# Altium project MB.PrjPcb (part 3 of 3)

## Sheet MB_dac.SchDoc: Материнская плата
size 420 x 297 mm; DrawnBy: В.Титов; DocumentNumber: ХХХХ.468179.001 Э3; SheetNumber: 6; SheetTotal: 7; DocumentType: Схема электрическая принципиальная; Title2: Питание процессора
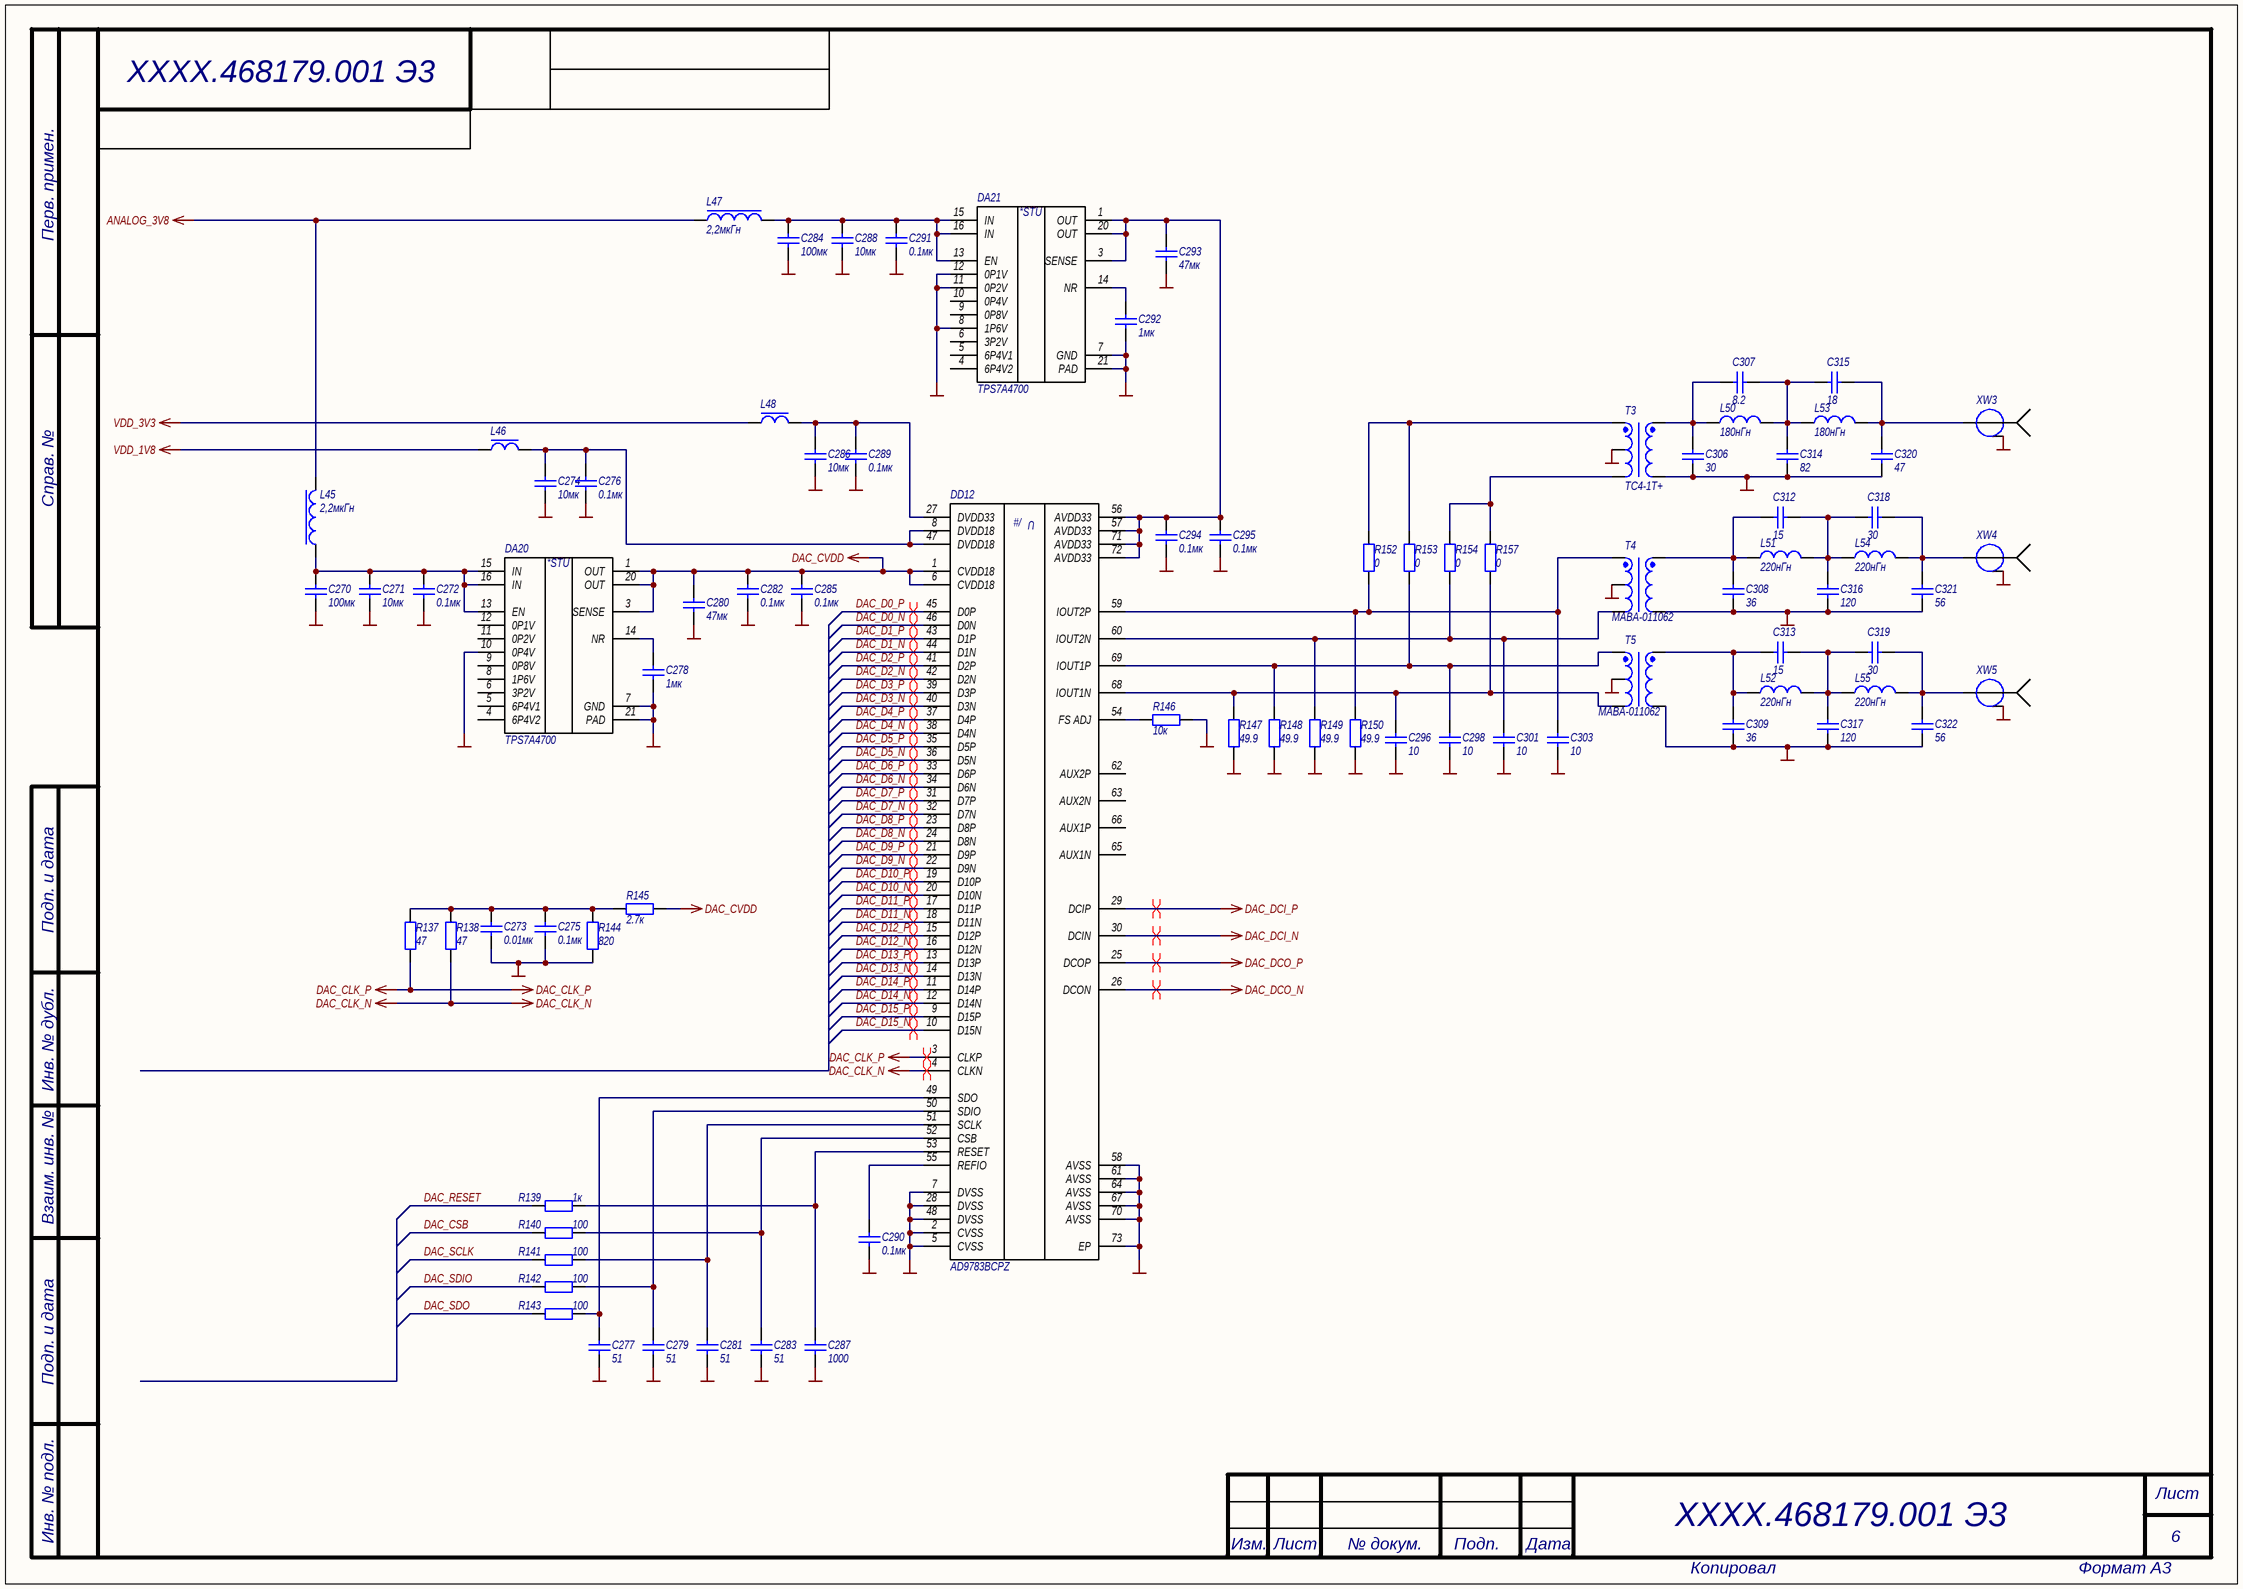
[diagram p5: MB_dac.SchDoc]

### Parts
C270  100мк  [CAPC3216X19L]
C271  10мк  [CAPC1608X08L]
C272  0.1мк  [CAPC1005X06N]
C273  0.01мк  [CAPC1005X06N]
C274  10мк  [CAPC1608X08L]
C275  0.1мк  [CAPC1005X06N]
C276  0.1мк  [CAPC1005X06N]
C277  51  [CAPC1005X06N]
C278  1мк  [CAPC1005X06N]
C279  51  [CAPC1005X06N]
C280  47мк  [CAPC2012X12L]
C281  51  [CAPC1005X06N]
C282  0.1мк  [CAPC1005X06N]
C283  51  [CAPC1005X06N]
C284  100мк  [CAPC3216X19L]
C285  0.1мк  [CAPC1005X06N]
C286  10мк  [CAPC1608X08L]
C287  1000  [CAPC1005X06N]
C288  10мк  [CAPC1608X08L]
C289  0.1мк  [CAPC1005X06N]
C290  0.1мк  [CAPC1005X06N]
C291  0.1мк  [CAPC1005X06N]
C292  1мк  [CAPC1005X06N]
C293  47мк  [CAPC2012X12L]
C294  0.1мк  [CAPC1005X06N]
C295  0.1мк  [CAPC1005X06N]
C296  10  [CAPC1005X06N]
C298  10  [CAPC1005X06N]
C301  10  [CAPC1005X06N]
C303  10  [CAPC1005X06N]
C306  30  [CAPC1005X06N]
C307  8.2  [CAPC1005X06N]
C308  36  [CAPC1005X06N]
C309  36  [CAPC1005X06N]
C312  15  [CAPC1005X06N]
C313  15  [CAPC1005X06N]
C314  82  [CAPC1005X06N]
C315  18  [CAPC1005X06N]
C316  120  [CAPC1005X06N]
C317  120  [CAPC1005X06N]
C318  30  [CAPC1005X06N]
C319  30  [CAPC1005X06N]
C320  47  [CAPC1005X06N]
C321  56  [CAPC1005X06N]
C322  56  [CAPC1005X06N]
DA20  TPS7A4700  [QFN65P500X500X100_HS-21L]
DA21  TPS7A4700  [QFN65P500X500X100_HS-21L]
DD12  AD9783BCPZ  [LFCSP_VQ_72]
L45  2,2мкГн  [CSAB0420]
L46  BLM18PG121SN1D  [INDC1608X08L]  (value not drawn)
L47  2,2мкГн  [CSAB0420]
L48  BLM18PG121SN1D  [INDC1608X08L]  (value not drawn)
L50  180нГн  [INDC0805CS]
L51  220нГн  [INDC0805CS]
L52  220нГн  [INDC0805CS]
L53  180нГн  [INDC0805CS]
L54  220нГн  [INDC0805CS]
L55  220нГн  [INDC0805CS]
R137  47  [RESC1005X06N]
R138  47  [RESC1005X06N]
R139  1к  [RESC1005X06N]
R140  100  [RESC1005X06N]
R141  100  [RESC1005X06N]
R142  100  [RESC1005X06N]
R143  100  [RESC1005X06N]
R144  820  [RESC1005X06N]
R145  2.7к  [RESC1005X06N]
R146  10к  [RESC1005X06N]
R147  49.9  [RESC1005X06N]
R148  49.9  [RESC1005X06N]
R149  49.9  [RESC1005X06N]
R150  49.9  [RESC1005X06N]
R152  0  [RESC1005X06N]
R153  0  [RESC1005X06N]
R154  0  [RESC1005X06N]
R157  0  [RESC1005X06N]
T3  TC4-1T+  [SM-22 package]
T4  MABA-011062  [SM-22 package]
T5  MABA-011062  [SM-22 package]
XW3  SMA-JR  [SMA-JR]  (value not drawn)
XW4  SMA-JR  [SMA-JR]  (value not drawn)
XW5  SMA-JR  [SMA-JR]  (value not drawn)

### Nets
ANALOG_3V8: L45.2 L47.1
DAC_CLK_N: DD12.4(CLKN) R138.2
DAC_CLK_P: DD12.3(CLKP) R137.2
DAC_CVDD: C280.2 C282.2 C285.2 DA20.1(OUT) DA20.3(SENSE) DA20.20(OUT) DD12.1(CVDD18) DD12.6(CVDD18) R145.2
DAC_DCI_N: DD12.30(DCIN)
DAC_DCI_P: DD12.29(DCIP)
DAC_DCO_N: DD12.26(DCON)
DAC_DCO_P: DD12.25(DCOP)
GND: C270.1 C271.1 C272.1 C273.1 C274.1 C275.1 C276.1 C277.1 C278.1 C279.1 C280.1 C281.1 C282.1 C283.1 C284.1 C285.1 C286.1 C287.1 C288.1 C289.1 C290.1 C291.1 C292.1 C293.1 C294.1 C295.1 C296.1 C298.1 C301.1 C303.1 C306.1 C308.1 C309.1 C314.1 C316.1 C317.1 C320.1 C321.1 C322.1 DA20.7(GND) DA20.10(0P4V) DA20.21(PAD) DA21.7(GND) DA21.8(1P6V) DA21.11(0P2V) DA21.12(0P1V) DA21.21(PAD) DD12.2(CVSS) DD12.5(CVSS) DD12.7(DVSS) DD12.28(DVSS) DD12.48(DVSS) DD12.58(AVSS) DD12.61(AVSS) DD12.64(AVSS) DD12.67(AVSS) DD12.70(AVSS) DD12.73(EP) R144.2 R146.2 R147.2 R148.2 R149.2 R150.2 T3.2(SECONARY_CT) T3.4(PRIMARY) T4.2(SECONARY_CT) T4.4(PRIMARY) T5.2(SECONARY_CT) T5.4(PRIMARY) XW3.2 XW4.2 XW5.2
VDD_1V8: L46.1
VDD_3V3: L48.1
DAC_CSB: R140.1
DAC_D0_N: DD12.46(D0N)
DAC_D0_P: DD12.45(D0P)
DAC_D1_N: DD12.44(D1N)
DAC_D1_P: DD12.43(D1P)
DAC_D2_N: DD12.42(D2N)
DAC_D2_P: DD12.41(D2P)
DAC_D3_N: DD12.40(D3N)
DAC_D3_P: DD12.39(D3P)
DAC_D4_N: DD12.38(D4N)
DAC_D4_P: DD12.37(D4P)
DAC_D5_N: DD12.36(D5N)
DAC_D5_P: DD12.35(D5P)
DAC_D6_N: DD12.34(D6N)
DAC_D6_P: DD12.33(D6P)
DAC_D7_N: DD12.32(D7N)
DAC_D7_P: DD12.31(D7P)
DAC_D8_N: DD12.24(D8N)
DAC_D8_P: DD12.23(D8P)
DAC_D9_N: DD12.22(D9N)
DAC_D9_P: DD12.21(D9P)
DAC_D10_N: DD12.20(D10N)
DAC_D10_P: DD12.19(D10P)
DAC_D11_N: DD12.18(D11N)
DAC_D11_P: DD12.17(D11P)
DAC_D12_N: DD12.16(D12N)
DAC_D12_P: DD12.15(D12P)
DAC_D13_N: DD12.14(D13N)
DAC_D13_P: DD12.13(D13P)
DAC_D14_N: DD12.12(D14N)
DAC_D14_P: DD12.11(D14P)
DAC_D15_N: DD12.10(D15N)
DAC_D15_P: DD12.9(D15P)
DAC_RESET: R139.1
DAC_SCLK: R141.1
DAC_SDIO: R142.1
DAC_SDO: R143.1
NetC270_2: C270.2 C271.2 C272.2 DA20.13(EN) DA20.15(IN) DA20.16(IN) L45.1
NetC273_2: C273.2 C275.2 R137.1 R138.1 R144.1 R145.1
NetC274_2: C274.2 C276.2 DD12.8(DVDD18) DD12.47(DVDD18) L46.2
NetC277_2: C277.2 DD12.49(SDO) R143.2
NetC278_2: C278.2 DA20.14(NR)
NetC279_2: C279.2 DD12.50(SDIO) R142.2
NetC281_2: C281.2 DD12.51(SCLK) R141.2
NetC283_2: C283.2 DD12.52(CSB) R140.2
NetC284_2: C284.2 C288.2 C291.2 DA21.13(EN) DA21.15(IN) DA21.16(IN) L47.2
NetC286_2: C286.2 C289.2 DD12.27(DVDD33) L48.2
NetC287_2: C287.2 DD12.53(RESET) R139.2
NetC290_2: C290.2 DD12.55(REFIO)
NetC292_2: C292.2 DA21.14(NR)
NetC293_2: C293.2 C294.2 C295.2 DA21.1(OUT) DA21.3(SENSE) DA21.20(OUT) DD12.56(AVDD33) DD12.57(AVDD33) DD12.71(AVDD33) DD12.72(AVDD33)
NetC296_2: C296.2 DD12.68(IOUT1N) R147.1 R157.2 T5.3(SECONDARY)
NetC298_2: C298.2 DD12.69(IOUT1P) R148.1 R153.2 T5.1(SECONDARY_DOT)
NetC301_2: C301.2 DD12.60(IOUT2N) R149.1 R154.2 T4.3(SECONDARY)
NetC303_2: C303.2 DD12.59(IOUT2P) R150.1 R152.2 T4.1(SECONDARY_DOT)
NetC306_2: C306.2 C307.2 L50.1 T3.5(PRIMARY_DOT)
NetC307_1: C307.1 C314.2 C315.2 L50.2 L53.1
NetC308_2: C308.2 C312.2 L51.1 T4.5(PRIMARY_DOT)
NetC309_2: C309.2 C313.2 L52.1 T5.5(PRIMARY_DOT)
NetC312_1: C312.1 C316.2 C318.2 L51.2 L54.1
NetC313_1: C313.1 C317.2 C319.2 L52.2 L55.1
NetC315_1: C315.1 C320.2 L53.2 XW3.1
NetC318_1: C318.1 C321.2 L54.2 XW4.1
NetC319_1: C319.1 C322.2 L55.2 XW5.1
NetDD12_54: DD12.54(FS_ADJ) R146.1
NetR152_1: R152.1 R153.1 T3.1(SECONDARY_DOT)
NetR154_1: R154.1 R157.1 T3.3(SECONDARY)

Not connected (* = marked no-connect by the designer): DA20 4(6P4V2) 5(6P4V1) 6(3P2V) 8(1P6V) 9(0P8V) 11(0P2V) 12(0P1V); DA21 4(6P4V2) 5(6P4V1) 6(3P2V) 9(0P8V) 10(0P4V); DD12 62(AUX2P) 63(AUX2N) 65(AUX1N) 66(AUX1P)

### Layout directives
differential pair: DAC_CLK_N, DAC_CLK_P, DAC_D0_N, DAC_D0_P, DAC_D1_N, DAC_D1_P, DAC_D2_N, DAC_D2_P, DAC_D3_N, DAC_D3_P, DAC_D4_N, DAC_D4_P, DAC_D5_N, DAC_D5_P, DAC_D6_N, DAC_D6_P, DAC_D7_N, DAC_D7_P, DAC_D8_N, DAC_D8_P, DAC_D9_N, DAC_D9_P, DAC_D10_N, DAC_D10_P, DAC_D11_N, DAC_D11_P, DAC_D12_N, DAC_D12_P, DAC_D13_N, DAC_D13_P, DAC_D14_N, DAC_D14_P, DAC_D15_N, DAC_D15_P, DAC_DCI_N, DAC_DCI_P, DAC_DCO_N, DAC_DCO_P

### Notes on the sheet
- Перв. примен.
- Справ. №
- Подп. и дата
- Инв. № дубл.
- Взаим. инв. №
- Инв. № подл.
- Лист
- Изм.
- № докум.
- Подп.
- Дата
- Копировал
- Формат А3
- (in symbol Микросхема AD9783BCPZ) U; #/
- (in symbol Микросхема TPS7A4700RGW) *STU

### Library data of the parts
C270 C284 = Кер.ЧИП конд. 1206 100мкФ X5R 20% 6.3В: Кер. ЧИП-конденсатор; Manufacturer: Murata; ManufacturerPartNumber: GRM31CR60J107ME39L; Power/Voltage: 6.3В; TKE: X5R; Tolerance: ±20%; Value: 100мк
C271 C274 C286 C288 = Кер.ЧИП конд. 0603 10мкФ X5R 20% 6.3В: Кер. ЧИП-конденсатор; Manufacturer: Murata; ManufacturerPartNumber: GRM188R61A106KE69D; Power/Voltage: 6.3В; TKE: X5R; Tolerance: ±20%; Value: 10мк
C272 C275 C276 C282 C285 C289-C291 C294 C295 = Кер.ЧИП конд. 0402 0.1мкФ X7R 10%, 16В: Кер. ЧИП-конденсатор; Power/Voltage: 16В; TKE: X7R; Tolerance: ±10%; PackageReference: 0402; Value: 0.1мк
C273 = Кер.ЧИП конд. 0402 0.01мкФ X7R 10%, 50В: Кер. ЧИП-конденсатор; Power/Voltage: 50В; TKE: X7R; Tolerance: ±20%; Value: 0.01мк
C277 C279 C281 C283 = Кер.ЧИП конд. 0402 51пФ NPO 5%, 50В: Кер. ЧИП-конденсатор; Power/Voltage: 50В; TKE: NPO; Tolerance: ±5%; PackageReference: 0402; Value: 51
C278 C292 = Кер.ЧИП конд. 0402 1мкФ X5R 10%, 10В: Кер. ЧИП-конденсатор; Power/Voltage: 10В; TKE: X5R; Tolerance: ±10%; PackageReference: 0402; Value: 1мк
C280 C293 = Кер.ЧИП конд. 0805 47мкФ X5R 20% 10В: Кер. ЧИП-конденсатор; Manufacturer: Murata; ManufacturerPartNumber: GRM21BR61A476ME15L; Power/Voltage: 10В; TKE: X5R; Tolerance: ±20%; Value: 47мк
C287 = Кер.ЧИП конд. 0402 1000пФ NP0 5%, 50В: Кер. ЧИП-конденсатор; Power/Voltage: 50В; TKE: NPO; Tolerance: ±5%; PackageReference: 0402; Value: 1000
C296 C298 C301 C303 = Кер.ЧИП конд. 0402 10пФ NPO 5%, 50В: Кер. ЧИП-конденсатор; Power/Voltage: 50В; TKE: NPO; Tolerance: ±5%; PackageReference: 0402; Value: 10
C306 C318 C319 = Кер.ЧИП конд. 0402 30пФ NPO 5%, 50В: Кер. ЧИП-конденсатор; Power/Voltage: 50В; TKE: NPO; Tolerance: ±5%; PackageReference: 0402; Value: 30
C307 = Кер.ЧИП конд. 0402 8.2пФ C0G, 50В: Кер. ЧИП-конденсатор; Power/Voltage: 50В; TKE: C0G; Tolerance: ±5%; Value: 8.2
C308 C309 = Кер.ЧИП конд. 0402 36пФ NPO 5%, 50В: Кер. ЧИП-конденсатор; Power/Voltage: 50В; TKE: NPO; Tolerance: ±5%; PackageReference: 0402; Value: 36
C312 C313 = Кер.ЧИП конд. 0402 15пФ NPO 5%, 50В: Кер. ЧИП-конденсатор; Power/Voltage: 50В; TKE: NPO; Tolerance: ±5%; PackageReference: 0402; Value: 15
C314 = Кер.ЧИП конд. 0402 82пФ NPO 5%, 50В: Кер. ЧИП-конденсатор; Power/Voltage: 50В; TKE: NPO; Tolerance: ±5%; PackageReference: 0402; Value: 82
C315 = Кер.ЧИП конд. 0402 18пФ NPO 5%, 50В: Кер. ЧИП-конденсатор; Power/Voltage: 50В; TKE: NPO; Tolerance: ±5%; PackageReference: 0402; Value: 18
C316 C317 = Кер.ЧИП конд. 0402 120пФ NPO 5%, 50В: Кер. ЧИП-конденсатор; Power/Voltage: 50В; TKE: NPO; Tolerance: ±5%; PackageReference: 0402; Value: 120
C320 = Кер.ЧИП конд. 0402 47пФ NPO 5%, 50В: Кер. ЧИП-конденсатор; Power/Voltage: 50В; TKE: NPO; Tolerance: ±5%; PackageReference: 0402; Value: 47
C321 C322 = Кер.ЧИП конд. 0402 56пФ NPO 5%, 50В: Кер. ЧИП-конденсатор; Power/Voltage: 50В; TKE: NPO; Tolerance: ±5%; PackageReference: 0402; Value: 56
DA20 DA21 = Микросхема TPS7A4700RGW: 36-V, 1-A, 4-µVRMS, RF LDO Voltage Regulator; Manufacturer: TI; Value: TPS7A4700; ComponentLink1Description: datasheet; ComponentLink1URL: http://www.ti.com/lit/ds/symlink/tps7a47.pdf
DD12 = Микросхема AD9783BCPZ: Dual 12-/14-/16-Bit, LVDS Interface, 500 MSPS DACs; Manufacturer: AD; Value: AD9783BCPZ; ComponentLink1Description: datasheet; ComponentLink1URL: http://www.analog.com/media/en/technical-documentation/data-sheets/AD9780_9781_9783.pdf
L45 L47 = ЧИП индуктивность CSAB0420-2R2M: Molding Power Choke; Manufacturer: Vishay; ManufacturerPartNumber: IHLP1616ABER1R0M11; Value: 2,2мкГн
L46 L48 = ЧИП дроссель 0603 BLM18PG121SN1D: SMD EMI Suppression Filter EMIFIL; Manufacturer: Murata; ManufacturerPartNumber: BLM18PG121SN1D; Value: BLM18PG121SN1D
L50 L53 = ЧИП индуктивность 0805CS-181XGL: Value: 180нГн
L51 L52 L54 L55 = ЧИП индуктивность 0805CS-221XGL: Value: 220нГн
R137 R138 = Чип резистор 0402 47 Ом, 5%: ЧИП-резистор; Tolerance: ±5%; TKE: 100 ppm/°С; PackageReference: 0402; Value: 47
R139 = Чип резистор 0402 1 кОм, 5%: ЧИП-резистор; Tolerance: ±5%; TKE: 100 ppm/°С; PackageReference: 0402; Value: 1к
R140-R143 = Чип резистор 0402 100 Ом, 5%: ЧИП-резистор; Tolerance: ±5%; TKE: 100 ppm/°С; PackageReference: 0402; Value: 100
R144 = Чип резистор 0402 820 Ом, 5%: ЧИП-резистор; Tolerance: ±5%; TKE: 100 ppm/°С; PackageReference: 0402; Value: 820
R145 = Чип резистор 0402 2.7 кОм, 5%: ЧИП-резистор; Tolerance: ±5%; TKE: 100 ppm/°С; Published: 8-Jun-2000; LatestRevisionDate: 17-Jul-2002; LatestRevisionNote: Re-released for DXP Platform.; Publisher: Altium Limited; PackageReference: 0402; Value: 2.7к
R146 = Чип резистор 0402 10 кОм, 5%: ЧИП-резистор; Tolerance: ±5%; TKE: 100 ppm/°С; PackageReference: 0402; Value: 10к
R147-R150 = Чип резистор 0402 49,9 Ом, 1%: ЧИП-резистор; Tolerance: ±1%; TKE: 100 ppm/°С; PackageReference: 0402; Value: 49.9
R152-R154 R157 = Чип резистор 0402 0 Ом: ЧИП-резистор; Tolerance: ±5%; TKE: 100 ppm/°С; PackageReference: 0402; Value: 0
T3 = ЧИП трансформатор TC4-1T+: RF Transformer 50Ω 0.5 to 300 MHz 1:4; Manufacturer: minicircuits; ManufacturerPartNumber: ADT2-1T+; Value: TC4-1T+; ComponentLink1Description: datasheet; ComponentLink1URL: https://ww2.minicircuits.com/pdfs/ADT2-1T+.pdf
T4 T5 = ЧИП трансформатор MABA-011062: 1:2 Step up Flux Coupled Balun Transformer 1 – 300 MHz; Manufacturer: MACOM; Value: MABA-011062; ComponentLink1Description: datasheet; ComponentLink1URL: https://cdn.macom.com/datasheets/MABA-011062.pdf; ManufacturerPartNumber: MABA-011062
XW3-XW5 = Соединитель коаксиальный SMA-JR: SMA-JR Разъем SMA гнездо на плату, прямой угол; Value: SMA-JR; ComponentLink1Description: datasheet; ComponentLink1URL: http://www.brownbear.ru/goods/2243.html

## Sheet MB_audio.SchDoc: Материнская плата
size 420 x 297 mm; DrawnBy: В.Титов; DocumentNumber: ХХХХ.468179.001 Э3; SheetNumber: 7; SheetTotal: 7; DocumentType: Схема электрическая принципиальная; Title2: Питание процессора
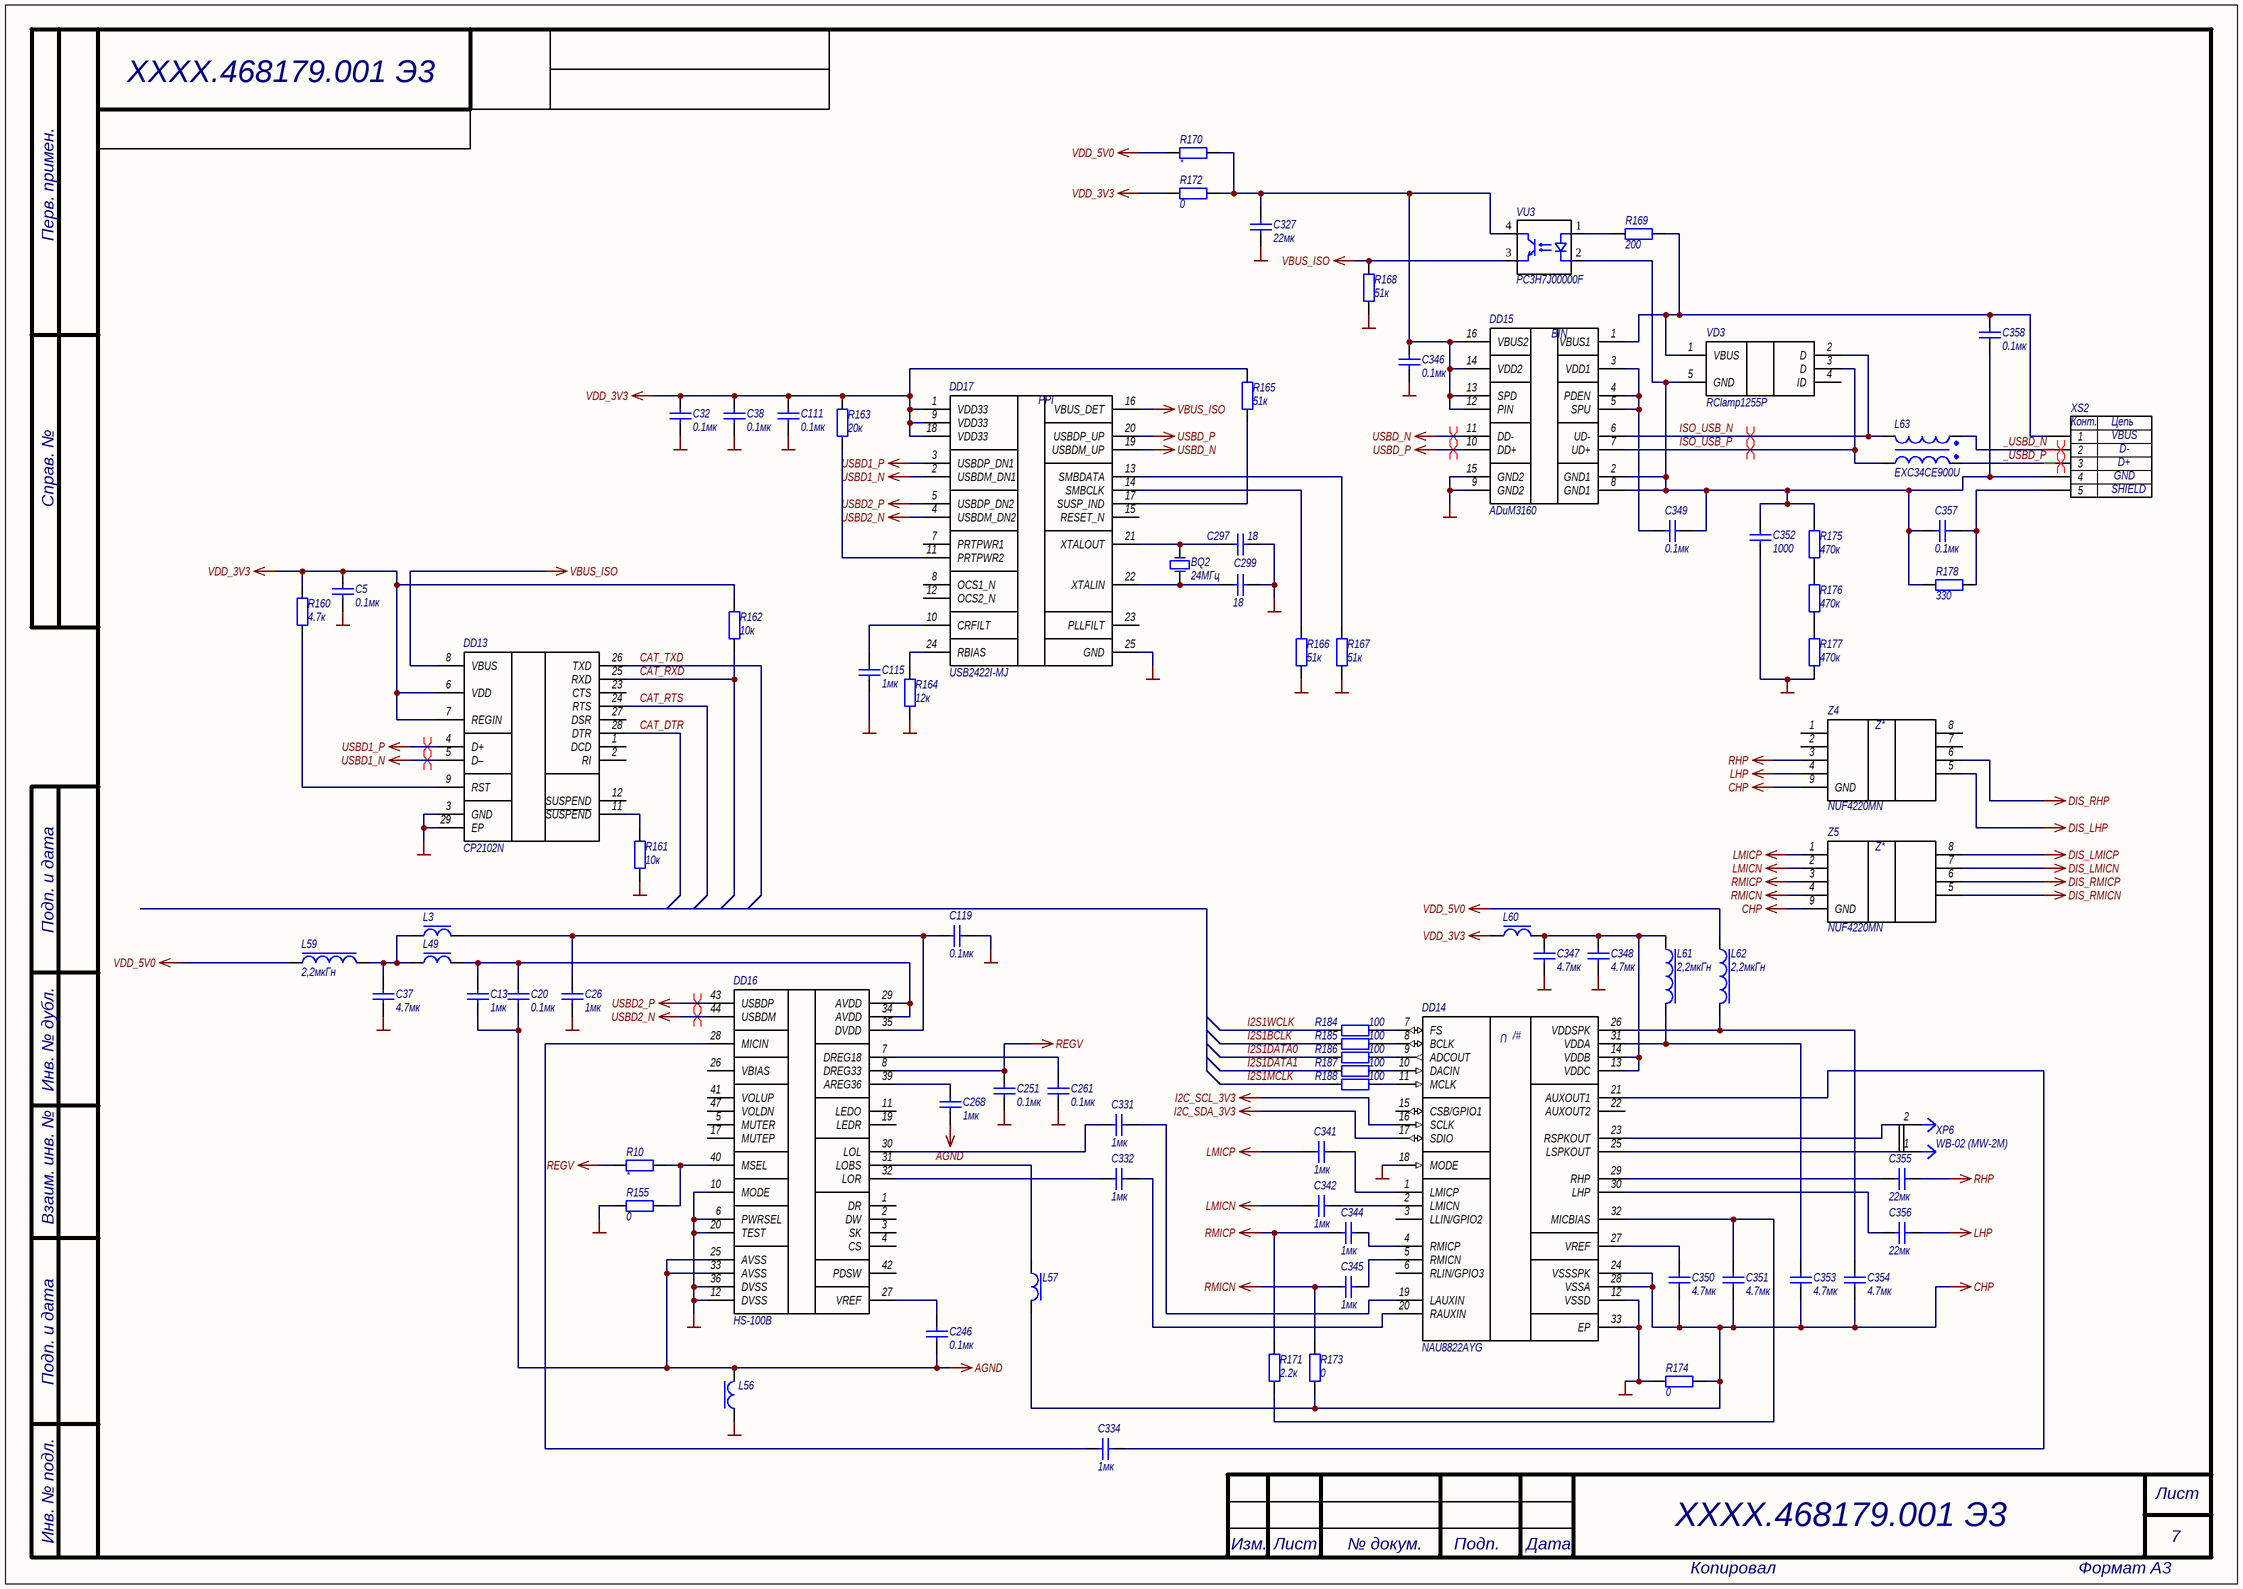
[diagram p6: MB_audio.SchDoc]

### Parts
BQ2  24МГц  [ABRACOM ABM10]
C5  0.1мк  [CAPC1005X06N]
C13  1мк  [CAPC1005X06N]
C20  0.1мк  [CAPC1005X06N]
C26  1мк  [CAPC1005X06N]
C32  0.1мк  [CAPC1005X06N]
C37  4.7мк  [CAPC2012X12L]
C38  0.1мк  [CAPC1005X06N]
C111  0.1мк  [CAPC1005X06N]
C115  1мк  [CAPC1005X06N]
C119  0.1мк  [CAPC1005X06N]
C246  0.1мк  [CAPC1005X06N]
C251  0.1мк  [CAPC1005X06N]
C261  0.1мк  [CAPC1005X06N]
C268  1мк  [CAPC1005X06N]
C297  18  [CAPC1005X06N]
C299  18  [CAPC1005X06N]
C327  22мк  [CAPC2012X12L]
C331  1мк  [CAPC1005X06N]
C332  1мк  [CAPC1005X06N]
C334  1мк  [CAPC1005X06N]
C341  1мк  [CAPC1005X06N]
C342  1мк  [CAPC1005X06N]
C344  1мк  [CAPC1005X06N]
C345  1мк  [CAPC1005X06N]
C346  0.1мк  [CAPC1005X06N]
C347  4.7мк  [CAPC2012X12L]
C348  4.7мк  [CAPC2012X12L]
C349  0.1мк  [CAPC1608X08L]
C350  4.7мк  [CAPC2012X12L]
C351  4.7мк  [CAPC2012X12L]
C352  1000  [CAPRD7.5-9x5]
C353  4.7мк  [CAPC2012X12L]
C354  4.7мк  [CAPC2012X12L]
C355  22мк  [CAPC2012X12L]
C356  22мк  [CAPC2012X12L]
C357  0.1мк  [CAPC1608X08L]
C358  0.1мк  [CAPC1608X08L]
DD13  CP2102N  [QFN50P500X500X80_HS-29N]
DD14  NAU8822AYG  [QFN50P500X500X100_HS-33L]
DD15  ADuM3160  [SOIC127P1030X265-16N]
DD16  HS-100B  [TSQFP50P900X900X160-48N]
DD17  USB2422I-MJ  [QFN50P400X400X80_HS-25L]
L3  BLM18PG121SN1D  [INDC1608X08L]  (value not drawn)
L49  BLM18PG121SN1D  [INDC1608X08L]  (value not drawn)
L56  BLM18PG121SN1D  [INDC1608X08L]  (value not drawn)
L57  BLM18PG121SN1D  [INDC1608X08L]  (value not drawn)
L59  2,2мкГн  [CSAB0420]
L60  BLM18PG121SN1D  [INDC1608X08L]  (value not drawn)
L61  2,2мкГн  [CSAB0420]
L62  2,2мкГн  [CSAB0420]
L63  EXC34CE900U  [EXC34CE900U]
R10  *  [RESC1005X06N]
R155  0  [RESC1005X06N]
R160  4.7к  [RESC1005X06N]
R161  10к  [RESC1005X06N]
R162  10к  [RESC1005X06N]
R163  20к  [RESC1005X06N]
R164  12к  [RESC1005X06N]
R165  51к  [RESC1005X06N]
R166  51к  [RESC1005X06N]
R167  51к  [RESC1005X06N]
R168  51к  [RESC1005X06N]
R169  200  [RESC1005X06N]
R170  *  [RESC1005X06N]
R171  2.2к  [RESC1005X06N]
R172  0  [RESC1005X06N]
R173  0  [RESC1005X06N]
R174  0  [RESC1005X06N]
R175  470к  [RESC1005X06N]
R176  470к  [RESC1005X06N]
R177  470к  [RESC1005X06N]
R178  330  [RESC1005X06N]
R184  100  [RESC1005X06N]
R185  100  [RESC1005X06N]
R186  100  [RESC1005X06N]
R187  100  [RESC1005X06N]
R188  100  [RESC1005X06N]
VD3  RClamp1255P  [SLP2018P6]
VU3  PC3H7J00000F  [SO4-170-1.27]
XP6  WB-02 (MW-2M)  [WB-02 (MW-2M) pitch 2.00mm]
XS2  USBB-1J  [USB2.5-2H4D]  (value not drawn)
Z4  NUF4220MN  [QFN50P200X200X80_HS-9L]
Z5  NUF4220MN  [QFN50P200X200X80_HS-9L]

### Nets
AGND: C13.1 C20.1 C246.1 C268.1 DD16.25(AVSS) DD16.33(AVSS) L56.2
CHP: C350.2 C351.2 C353.2 C354.2 DD14.24(VSSSPK) DD14.28(VSSA) L57.2 R173.1 R174.2 Z4.9(GND) Z5.9(GND)
DIS_LHP: Z4.5
DIS_LMICN: Z5.7
DIS_LMICP: Z5.8
DIS_RHP: Z4.6
DIS_RMICN: Z5.5
DIS_RMICP: Z5.6
GND: C5.1 C26.2 C32.1 C37.2 C38.1 C111.1 C115.1 C119.1 C251.1 C261.1 C297.2 C299.2 C327.1 C346.1 C347.2 C348.2 C352.2 DD13.3(GND) DD13.29(EP) DD14.12(VSSD) DD14.18(MODE) DD14.33(EP) DD15.9(GND2) DD15.15(GND2) DD16.6(PWRSEL) DD16.10(MODE) DD16.12(DVSS) DD16.20(TEST) DD16.36(DVSS) DD17.25(GND) L56.1 R155.2 R161.1 R164.1 R166.1 R167.1 R168.1 R174.1 R177.1
I2C_SCL_3V3: DD14.16(SCLK)
I2C_SDA_3V3: DD14.17(SDIO)
LHP: C356.1 Z4.4
LMICN: C342.1 Z5.2
LMICP: C341.1 Z5.1
REGV: C251.2 DD16.8(DREG33) R10.2
RHP: C355.1 Z4.3
RMICN: C345.1 R173.2 Z5.4
RMICP: C344.1 R171.2 Z5.3
USBD1_N: DD13.5(D–) DD17.2(USBDM_DN1)
USBD1_P: DD13.4(D+) DD17.3(USBDP_DN1)
USBD2_N: DD16.44(USBDM) DD17.4(USBDM_DN2)
USBD2_P: DD16.43(USBDP) DD17.5(USBDP_DN2)
USBD_N: DD15.11(DD-) DD17.19(USBDM_UP)
USBD_P: DD15.10(DD+) DD17.20(USBDP_UP)
VBUS_ISO: DD13.8(VBUS) DD17.16(VBUS_DET) R168.2 VU3.3(E)
VDD_3V3: C5.2 C32.2 C38.2 C111.2 DD13.6(VDD) DD13.7(REGIN) DD17.1(VDD33) DD17.9(VDD33) DD17.18(VDD33) L60.1 R160.2 R162.2 R163.2 R165.2 R172.2
VDD_5V0: L59.1 L62.1 R170.2
_USBD_N: L63.1 XS2.2
_USBD_P: L63.4 XS2.3
CAT_DTR: DD13.28(DTR)
CAT_RTS: DD13.24(RTS)
CAT_RXD: DD13.25(RXD) R162.1
CAT_TXD: DD13.26(TXD)
I2S1BCLK: R185.1
I2S1DATA0: R186.1
I2S1DATA1: R187.1
I2S1MCLK: R188.1
I2S1WCLK: R184.1
ISO_USB_N: DD15.6(UD-) L63.2 VD3.2(D)
ISO_USB_P: DD15.7(UD+) L63.3 VD3.3(D)
NetBQ2_1: BQ2.1(OSC1) C297.1 DD17.21(XTALOUT)
NetBQ2_3: BQ2.3(OSC2) C299.1 DD17.22(XTALIN)
NetC13_2: C13.2 C20.2 DD16.29(AVDD) DD16.34(AVDD) L49.2
NetC26_1: C26.1 C119.2 DD16.35(DVDD) L3.2
NetC37_1: C37.1 L3.1 L49.1 L59.2
NetC115_2: C115.2 DD17.10(CRFILT)
NetC246_2: C246.2 DD16.27(VREF)
NetC261_2: C261.2 DD16.7(DREG18)
NetC268_2: C268.2 DD16.39(AREG36)
NetC327_2: C327.2 C346.2 DD15.12(PIN) DD15.13(SPD) DD15.14(VDD2) DD15.16(VBUS2) R170.1 R172.1 VU3.4(C)
NetC331_1: C331.1 DD16.30(LOL)
NetC331_2: C331.2 DD14.19(LAUXIN)
NetC332_1: C332.1 DD16.32(LOR)
NetC332_2: C332.2 DD14.20(RAUXIN)
NetC334_1: C334.1 DD16.28(MICIN)
NetC334_2: C334.2 DD14.21(AUXOUT1)
NetC341_2: C341.2 DD14.1(LMICP)
NetC342_2: C342.2 DD14.2(LMICN)
NetC344_2: C344.2 DD14.4(RMICP)
NetC345_2: C345.2 DD14.5(RMICN)
NetC347_1: C347.1 C348.1 DD14.13(VDDC) DD14.14(VDDB) L60.2 L61.1
NetC349_1: C349.1 C352.1 C357.2 C358.1 DD15.2(GND1) DD15.8(GND1) R175.2 R178.2 VD3.5(GND) VU3.2(K) XS2.4
NetC349_2: C349.2 DD15.3(VDD1) DD15.4(PDEN) DD15.5(SPU)
NetC350_1: C350.1 DD14.27(VREF)
NetC351_1: C351.1 DD14.32(MICBIAS) R171.1
NetC353_1: C353.1 DD14.31(VDDA) L61.2
NetC354_1: C354.1 DD14.26(VDDSPK) L62.2
NetC355_2: C355.2 DD14.29(RHP)
NetC356_2: C356.2 DD14.30(LHP)
NetC357_1: C357.1 R178.1 XS2.5
NetC358_2: C358.2 DD15.1(VBUS1) R169.1 VD3.1(VBUS) XS2.1
NetDD13_9: DD13.9(RST) R160.1
NetDD13_11: DD13.11(~{SUSPEND}) R161.2
NetDD14_7: DD14.7(FS) R184.2
NetDD14_8: DD14.8(BCLK) R185.2
NetDD14_9: DD14.9(ADCOUT) R186.2
NetDD14_10: DD14.10(DACIN) R187.2
NetDD14_11: DD14.11(MCLK) R188.2
NetDD14_23: DD14.23(RSPKOUT) XP6.2
NetDD14_25: DD14.25(LSPKOUT) XP6.1
NetDD16_31: DD16.31(LOBS) L57.1
NetDD16_40: DD16.40(MSEL) R10.1 R155.1
NetDD17_11: DD17.11(PRTPWR2) R163.1
NetDD17_13: DD17.13(SMBDATA) R167.2
NetDD17_14: DD17.14(SMBCLK) R166.2
NetDD17_17: DD17.17(SUSP_IND) R165.1
NetDD17_24: DD17.24(RBIAS) R164.2
NetR169_2: R169.2 VU3.1(A)
NetR175_1: R175.1 R176.2
NetR176_1: R176.1 R177.2

Not connected (* = marked no-connect by the designer): DD13 1(DCD) 2(RI) 12(SUSPEND) 23(CTS) 27(DSR); DD14 3(LLIN/GPIO2) 6(RLIN/GPIO3) 15(CSB/GPIO1) 22(AUXOUT2); DD16 1(DR) 2(DW) 3(SK) 4(CS) 5(MUTER) 11(LEDO) 17(MUTEP) 19(LEDR) 26(VBIAS) 41(VOLUP) 42(PDSW) 47(VOLDN); DD17 7(PRTPWR1) 8(OCS1_N) 12(OCS2_N) 15(RESET_N) 23(PLLFILT); VD3 4(ID); Z4 1 2 7 8

### Layout directives
differential pair: _USBD_N, _USBD_P, ISO_USB_N, ISO_USB_P, USBD1_N, USBD1_P, USBD2_N, USBD2_P, USBD_N, USBD_P

### Notes on the sheet
- Перв. примен.
- Справ. №
- Подп. и дата
- Инв. № дубл.
- Взаим. инв. №
- Инв. № подл.
- Лист
- Изм.
- № докум.
- Подп.
- Дата
- Копировал
- Формат А3
- (in symbol Микросхема ADuM3160) BIN
- (in symbol Микросхема NAU8822AYG) U; /#
- (in symbol Микросхема USB2422I-MJ) PPI
- (in symbol Соединитель USBB-1J) Конт.; Цепь; VBUS; D-; D+; GND; SHIELD
- (in symbol Фильтр EMI NUF4220MN) Z*

### Library data of the parts
BQ2 = Кварц ABM10AIG-24.000MHZ-4Z-T3: Резонатор кварцевый; Manufacturer: ABRACON; Tolerance: ±50 ppm; Value: 24МГц
C5 C20 C32 C38 C111 C119 C246 C251 C261 C346 = Кер.ЧИП конд. 0402 0.1мкФ X7R 10%, 16В: as C272 on sheet MB_dac; PackageReference: 0402; Value: 0.1мк
C13 C26 C115 C268 C331 C332 C334 C341 C342 C344 C345 = Кер.ЧИП конд. 0402 1мкФ X5R 10%, 10В: as C278 on sheet MB_dac; Value: 1мк; PackageReference: 0402
C37 C347 C348 C350 C351 C353 C354 = Кер.ЧИП конд. 0805 4,7мкФ X5R 20% 16В: Кер. ЧИП-конденсатор; Manufacturer: Murata; ManufacturerPartNumber: GRM21BR61A476ME15L; Power/Voltage: 16В; TKE: X5R; Tolerance: ±20%; Value: 4.7мк
C297 C299 = Кер.ЧИП конд. 0402 18пФ NPO 5%, 50В: as C315 on sheet MB_dac; Value: 18; PackageReference: 0402
C327 = Кер.ЧИП конд. 0805 22мкФ X5R 10% 16В: Кер. ЧИП-конденсатор; Manufacturer: TDK; ManufacturerPartNumber: C2012X5R1C226KT; Power/Voltage: 16В; TKE: X5R; Tolerance: ±10%; Value: 22мк
C349 C357 C358 = Кер.ЧИП конд. 0603 0.1мкФ X7R 10% 50В: Кер. ЧИП-конденсатор; Manufacturer: Murata; ManufacturerPartNumber: GRM188R71H104KA93D; Power/Voltage: 50В; TKE: X7R; Tolerance: ±10%; Value: 0.1мк
C352 = Конденсатор керамический защищенный 1000pF 250V AC (DE1E3KX102MA4BN01F): Защищенные конденсаторы 1000pF 250Vrms 20% L/S=10mm Bulk long; Manufacturer: MURATA; Power/Voltage: 250VAC; TKE: X1Y1; Tolerance: ±10%; Published: 8-Jun-2000; LatestRevisionDate: 17-Jul-2002; LatestRevisionNote: Re-released for DXP Platform.; Publisher: Altium Limited; PackageReference: Type KX Small Size; ManufacturerPartNumber: DE1E3KX102MA4BN01F; Value: 1000
C355 C356 = Кер.ЧИП конд. 0805 22мкФ X5R 10% 16В: Кер. ЧИП-конденсатор; Manufacturer: TDK; ManufacturerPartNumber: C2012X5R1C226KT; Power/Voltage: 16В; Tolerance: ±10%; TKE: X5R; Value: 22мк
DD13 = Микросхема CP2102N-A02-GQFN28: Single-Chip USB-to-UART Data Transfer; Manufacturer: Silicon Labs; Value: CP2102N; ComponentLink1Description: datasheet; ComponentLink1URL: https://www.silabs.com/documents/public/data-sheets/cp2102n-datasheet.pdf
DD14 = Микросхема NAU8822AYG: 24-bit Stereo Audio Codec with Speaker Driver; Manufacturer: NUVOTON; Value: NAU8822AYG
DD15 = Микросхема ADuM3160: Full/Low Speed 2.5 kV USB Digital Isolator /; Manufacturer: AD; Value: ADuM3160; ComponentLink1Description: datasheet; ComponentLink1URL: https://www.analog.com/media/en/technical-documentation/data-sheets/ADuM5210_5211_5212.pdf
DD16 = Микросхема HS-100B: A Highly Integrated USB Audio Single Chip; Manufacturer: Cmedia; Value: HS-100B; ComponentLink1Description: datasheet
DD17 = Микросхема USB2422I-MJ: 2-Port USB 2.0 Hi-Speed Hub Controller; Manufacturer: Microchip; Value: USB2422I-MJ; ComponentLink1Description: datasheet; ComponentLink1URL: https://ww1.microchip.com/downloads/en/devicedoc/00001726b.pdf
L3 L49 L56 L57 L60 = ЧИП дроссель 0603 BLM18PG121SN1D: as L46 on sheet MB_dac; ManufacturerPartNumber: BLM18PG121SN1D; Value: BLM18PG121SN1D
L59 L61 L62 = ЧИП индуктивность CSAB0420-2R2M: as L45 on sheet MB_dac; Value: 2,2мкГн
L63 = ЧИП синфазный фильтр 0805 EXC34CE900U: Common Mode Noise Filters EXC34CG/CE type; Manufacturer: Panasonic; ManufacturerPartNumber: EXC34CE900U; Value: EXC34CE900U; ComponentLink1Description: datasheet; ComponentLink1URL: https://industrial.panasonic.com/cdbs/www-data/pdf/AWE0000/AWE0000C276.pdf
R10 R170 = Чип резистор 0402 *: ЧИП-резистор; Tolerance: ±5%; TKE: 100 ppm/°С; PackageReference: 0402; Value: *
R155 R172-R174 = Чип резистор 0402 0 Ом: as R152 on sheet MB_dac; PackageReference: 0402; Value: 0
R160 = Чип резистор 0402 4,7 кОм, 5%: ЧИП-резистор; Tolerance: ±5%; TKE: 100 ppm/°С; PackageReference: 0402; Value: 4.7к
R161 R162 = Чип резистор 0402 10 кОм, 5%: as R146 on sheet MB_dac; PackageReference: 0402; Value: 10к
R163 = Чип резистор 0402 20 кОм, 5%: ЧИП-резистор; Tolerance: ±5%; TKE: 100 ppm/°С; PackageReference: 0402; Value: 20к
R164 = Чип резистор 0402 12 кОм, 5%: ЧИП-резистор; Tolerance: ±5%; TKE: 100 ppm/°С; PackageReference: 0402; Value: 12к
R165-R168 = Чип резистор 0402 51 кОм, 5%: ЧИП-резистор; Tolerance: ±5%; TKE: 100 ppm/°С; PackageReference: 0402; Value: 51к
R169 = Чип резистор 0402 200 Ом, 5%: ЧИП-резистор; Tolerance: ±5%; TKE: 100 ppm/°С; PackageReference: 0402; Value: 200
R171 = Чип резистор 0402 2,2 кОм, 5%: ЧИП-резистор; Tolerance: ±5%; TKE: 100 ppm/°С; PackageReference: 0402; Value: 2.2к
R175-R177 = Чип резистор 0402 470 кОм, 5%: ЧИП-резистор; Tolerance: ±5%; TKE: 100 ppm/°С; PackageReference: 0402; Value: 470к
R178 = Чип резистор 0402 330 Ом, 5%: ЧИП-резистор; Tolerance: ±5%; TKE: 100 ppm/°С; PackageReference: 0402; Value: 330
R184-R188 = Чип резистор 0402 100 Ом, 5%: as R140 on sheet MB_dac; PackageReference: 0402; Value: 100
VD3 = Диодная сборка RClamp1255P: Low Capacitance RClamp Surge Protection for uUSB Interfaces; Manufacturer: SEMTECH; PackageReference: SLP1510N6; Value: RClamp1255P
VU3 = Оптопара транзисторная PC3H7J00000F: Mini-falt Package, General Purpose Half Pitch Photocouper; PackageReference: SOP-4; ComponentLink1Description: Manufacturer Link; ComponentLink1URL: http://www.vishay.com/optocouplers/list/product-83640/; ComponentLink2Description: Datasheet; ComponentLink2URL: http://www.vishay.com/docs/83640/83640.pdf; Value: PC3H7J00000F
XP6 = Соединитель WB-02 (MW-2M): Соединитель; Value: WB-02 (MW-2M)
XS2 = Соединитель USBB-1J: Universal Serial Bus (USB) Shielded I/O Receptacle, Right Angle, Type B; Manufacturer: Connfly; Value: USBB-1J
Z4 Z5 = Фильтр EMI NUF4220MN: ESD/EMI Protection  for Audio Interfaces; Manufacturer: onsemi; PackageReference: DFN8; Value: NUF4220MN

## Nets that join several sheets
ANALOG_3V8: MB_pwr_in_v2 (C41.2 L7.2), MB_adc_clk (L22.1 L31.1 L32.1), MB_dac (L45.2 L47.1)
ATT_CLK: MB_ps_io (DD1.D6    ), MB_adc_clk (R89.2 R92.2)
ATT_DATA: MB_ps_io (DD1.F11   ), MB_adc_clk (R88.2 R91.2)
ATT_LE0: MB_ps_io (DD1.A14   ), MB_adc_clk (R90.2)
ATT_LE1: MB_ps_io (DD1.E11   ), MB_adc_clk (R93.2)
CHP: MB_ps_io (XP3.5 XP3.7), MB_audio (11 pins)
DAC_CLK_N: MB_adc_clk (C253.1), MB_dac (DD12.4 R138.2)
DAC_CLK_P: MB_adc_clk (C248.1), MB_dac (DD12.3 R137.2)
DAC_DCI_N: MB_pl_io (DD1.Y16   ), MB_dac (DD12.30)
DAC_DCI_P: MB_pl_io (DD1.W16   ), MB_dac (DD12.29)
DAC_DCO_N: MB_pl_io (DD1.AA19  ), MB_dac (DD12.26)
DAC_DCO_P: MB_pl_io (DD1.Y19   ), MB_dac (DD12.25)
DIS_LHP: MB_ps_io (XP3.4), MB_audio (Z4.5)
DIS_LMICN: MB_ps_io (XP3.11), MB_audio (Z5.7)
DIS_LMICP: MB_ps_io (XP3.10), MB_audio (Z5.8)
DIS_RHP: MB_ps_io (XP3.6), MB_audio (Z4.6)
DIS_RMICN: MB_ps_io (XP3.9), MB_audio (Z5.5)
DIS_RMICP: MB_ps_io (XP3.8), MB_audio (Z5.6)
GND: MB_pwr_in_v2 (130 pins), MB_ps_io (71 pins), MB_ddr (65 pins), MB_pl_io (61 pins), MB_adc_clk (163 pins), MB_dac (73 pins), MB_audio (39 pins)
I2C_SCL_3V3: MB_ps_io (DD1.B6     R32.2), MB_adc_clk (DD8.6), MB_audio (DD14.16)
I2C_SDA_3V3: MB_ps_io (DD1.E6     R31.2), MB_adc_clk (DD8.7), MB_audio (DD14.17)
PG_1V5: MB_pwr_in_v2 (5 pins), MB_ddr (DA10.4)
PG_5V0: MB_pwr_in_v2 (5 pins), MB_ddr (DA10.7)
PG_ALL: MB_pwr_in_v2 (DA6.4), MB_ps_io (C67.2 DD1.B5     R28.1)
VCC_12V0: MB_pwr_in_v2 (23 pins), MB_ps_io (XP3.2 XP3.3), MB_ddr (C87.2 C88.2 DA10.3)
VDD_1V8: MB_pwr_in_v2 (19 pins), MB_ps_io (DD1.K11   ), MB_dac (L46.1)
VDD_2V5: MB_pwr_in_v2 (C30.2 C36.2 L1.2 R7.2), MB_pl_io (41 pins)
VDD_3V3: MB_pwr_in_v2 (C34.2 C40.2 L5.2 R15.2), MB_ps_io (40 pins), MB_pl_io (13 pins), MB_dac (L48.1), MB_audio (15 pins)
VDD_5V0: MB_pwr_in_v2 (5 pins), MB_ps_io (L10.1 R44.2 XP4.2), MB_audio (L59.1 L62.1 R170.2)
ADC0_D0_N: MB_pl_io (DD1.K20   ), MB_adc_clk (DD10.21)
ADC0_D0_P: MB_pl_io (DD1.K19   ), MB_adc_clk (DD10.22)
ADC0_D1_N: MB_pl_io (DD1.K18   ), MB_adc_clk (DD10.23)
ADC0_D1_P: MB_pl_io (DD1.J18   ), MB_adc_clk (DD10.24)
ADC0_D2_N: MB_pl_io (DD1.M17   ), MB_adc_clk (DD10.25)
ADC0_D2_P: MB_pl_io (DD1.L17   ), MB_adc_clk (DD10.26)
ADC0_D3_N: MB_pl_io (DD1.K15   ), MB_adc_clk (DD10.27)
ADC0_D3_P: MB_pl_io (DD1.J15   ), MB_adc_clk (DD10.28)
ADC0_D4_N: MB_pl_io (DD1.J17   ), MB_adc_clk (DD10.29)
ADC0_D4_P: MB_pl_io (DD1.J16   ), MB_adc_clk (DD10.30)
ADC0_D5_N: MB_pl_io (DD1.J22   ), MB_adc_clk (DD10.33)
ADC0_D5_P: MB_pl_io (DD1.J21   ), MB_adc_clk (DD10.34)
ADC0_D6_N: MB_pl_io (DD1.L22   ), MB_adc_clk (DD10.35)
ADC0_D6_P: MB_pl_io (DD1.L21   ), MB_adc_clk (DD10.36)
ADC0_D7_N: MB_pl_io (DD1.M22   ), MB_adc_clk (DD10.37)
ADC0_D7_P: MB_pl_io (DD1.M21   ), MB_adc_clk (DD10.38)
ADC0_D8_N: MB_pl_io (DD1.P22   ), MB_adc_clk (DD10.41)
ADC0_D8_P: MB_pl_io (DD1.N22   ), MB_adc_clk (DD10.42)
ADC0_D9_N: MB_pl_io (DD1.L19   ), MB_adc_clk (DD10.43)
ADC0_D9_P: MB_pl_io (DD1.L18   ), MB_adc_clk (DD10.44)
ADC0_D10_N: MB_pl_io (DD1.K21   ), MB_adc_clk (DD10.45)
ADC0_D10_P: MB_pl_io (DD1.J20   ), MB_adc_clk (DD10.46)
ADC0_D11_N: MB_pl_io (DD1.M16   ), MB_adc_clk (DD10.47)
ADC0_D11_P: MB_pl_io (DD1.M15   ), MB_adc_clk (DD10.48)
ADC0_D12_N: MB_pl_io (DD1.N18   ), MB_adc_clk (DD10.51)
ADC0_D12_P: MB_pl_io (DD1.N17   ), MB_adc_clk (DD10.52)
ADC0_D13_N: MB_pl_io (DD1.P18   ), MB_adc_clk (DD10.53)
ADC0_D13_P: MB_pl_io (DD1.P17   ), MB_adc_clk (DD10.54)
ADC0_D14_N: MB_pl_io (DD1.P21   ), MB_adc_clk (DD10.55)
ADC0_D14_P: MB_pl_io (DD1.P20   ), MB_adc_clk (DD10.56)
ADC0_D15_N: MB_pl_io (DD1.R21   ), MB_adc_clk (DD10.57)
ADC0_D15_P: MB_pl_io (DD1.R20   ), MB_adc_clk (DD10.58)
ADC1_D0_N: MB_pl_io (DD1.C19   ), MB_adc_clk (DD11.21)
ADC1_D0_P: MB_pl_io (DD1.D18   ), MB_adc_clk (DD11.22)
ADC1_D1_N: MB_pl_io (DD1.C18   ), MB_adc_clk (DD11.23)
ADC1_D1_P: MB_pl_io (DD1.C17   ), MB_adc_clk (DD11.24)
ADC1_D2_N: MB_pl_io (DD1.D17   ), MB_adc_clk (DD11.25)
ADC1_D2_P: MB_pl_io (DD1.D16   ), MB_adc_clk (DD11.26)
ADC1_D3_N: MB_pl_io (DD1.B15   ), MB_adc_clk (DD11.27)
ADC1_D3_P: MB_pl_io (DD1.C15   ), MB_adc_clk (DD11.28)
ADC1_D4_N: MB_pl_io (DD1.B17   ), MB_adc_clk (DD11.29)
ADC1_D4_P: MB_pl_io (DD1.B16   ), MB_adc_clk (DD11.30)
ADC1_D5_N: MB_pl_io (DD1.A17   ), MB_adc_clk (DD11.33)
ADC1_D5_P: MB_pl_io (DD1.A16   ), MB_adc_clk (DD11.34)
ADC1_D6_N: MB_pl_io (DD1.A19   ), MB_adc_clk (DD11.35)
ADC1_D6_P: MB_pl_io (DD1.A18   ), MB_adc_clk (DD11.36)
ADC1_D7_N: MB_pl_io (DD1.A22   ), MB_adc_clk (DD11.37)
ADC1_D7_P: MB_pl_io (DD1.A21   ), MB_adc_clk (DD11.38)
ADC1_D8_N: MB_pl_io (DD1.B22   ), MB_adc_clk (DD11.41)
ADC1_D8_P: MB_pl_io (DD1.B21   ), MB_adc_clk (DD11.42)
ADC1_D9_N: MB_pl_io (DD1.C22   ), MB_adc_clk (DD11.43)
ADC1_D9_P: MB_pl_io (DD1.D22   ), MB_adc_clk (DD11.44)
ADC1_D10_N: MB_pl_io (DD1.D21   ), MB_adc_clk (DD11.45)
ADC1_D10_P: MB_pl_io (DD1.E21   ), MB_adc_clk (DD11.46)
ADC1_D11_N: MB_pl_io (DD1.F22   ), MB_adc_clk (DD11.47)
ADC1_D11_P: MB_pl_io (DD1.F21   ), MB_adc_clk (DD11.48)
ADC1_D12_N: MB_pl_io (DD1.C20   ), MB_adc_clk (DD11.51)
ADC1_D12_P: MB_pl_io (DD1.D20   ), MB_adc_clk (DD11.52)
ADC1_D13_N: MB_pl_io (DD1.G22   ), MB_adc_clk (DD11.53)
ADC1_D13_P: MB_pl_io (DD1.H22   ), MB_adc_clk (DD11.54)
ADC1_D14_N: MB_pl_io (DD1.E20   ), MB_adc_clk (DD11.55)
ADC1_D14_P: MB_pl_io (DD1.E19   ), MB_adc_clk (DD11.56)
ADC1_D15_N: MB_pl_io (DD1.E18   ), MB_adc_clk (DD11.57)
ADC1_D15_P: MB_pl_io (DD1.F18   ), MB_adc_clk (DD11.58)
CAT_DTR: MB_pl_io (DD1.W8    ), MB_audio (DD13.28)
CAT_RTS: MB_pl_io (DD1.U10   ), MB_audio (DD13.24)
CAT_RXD: MB_ps_io (DD1.D11   ), MB_audio (DD13.25 R162.1)
CAT_TXD: MB_ps_io (DD1.C14   ), MB_audio (DD13.26)
CLKOUT0_N: MB_pl_io (DD1.M20   ), MB_adc_clk (DD10.39)
CLKOUT0_P: MB_pl_io (DD1.M19   ), MB_adc_clk (DD10.40)
CLKOUT1_N: MB_pl_io (DD1.B20   ), MB_adc_clk (DD11.39)
CLKOUT1_P: MB_pl_io (DD1.B19   ), MB_adc_clk (DD11.40)
CW_KEY: MB_ps_io (DD5.4), MB_pl_io (DD1.V8    )
DAC_CSB: MB_ps_io (DD1.B14   ), MB_dac (R140.1)
DAC_D0_N: MB_pl_io (DD1.V19   ), MB_dac (DD12.46)
DAC_D0_P: MB_pl_io (DD1.V18   ), MB_dac (DD12.45)
DAC_D1_N: MB_pl_io (DD1.AA14  ), MB_dac (DD12.44)
DAC_D1_P: MB_pl_io (DD1.Y14   ), MB_dac (DD12.43)
DAC_D2_N: MB_pl_io (DD1.U16   ), MB_dac (DD12.42)
DAC_D2_P: MB_pl_io (DD1.U15   ), MB_dac (DD12.41)
DAC_D3_N: MB_pl_io (DD1.W21   ), MB_dac (DD12.40)
DAC_D3_P: MB_pl_io (DD1.W20   ), MB_dac (DD12.39)
DAC_D4_N: MB_pl_io (DD1.AA13  ), MB_dac (DD12.38)
DAC_D4_P: MB_pl_io (DD1.Y13   ), MB_dac (DD12.37)
DAC_D5_N: MB_pl_io (DD1.V17   ), MB_dac (DD12.36)
DAC_D5_P: MB_pl_io (DD1.U17   ), MB_dac (DD12.35)
DAC_D6_N: MB_pl_io (DD1.AB15  ), MB_dac (DD12.34)
DAC_D6_P: MB_pl_io (DD1.AB14  ), MB_dac (DD12.33)
DAC_D7_N: MB_pl_io (DD1.AB16  ), MB_dac (DD12.32)
DAC_D7_P: MB_pl_io (DD1.AA16  ), MB_dac (DD12.31)
DAC_D8_N: MB_pl_io (DD1.AB17  ), MB_dac (DD12.24)
DAC_D8_P: MB_pl_io (DD1.AA17  ), MB_dac (DD12.23)
DAC_D9_N: MB_pl_io (DD1.AB20  ), MB_dac (DD12.22)
DAC_D9_P: MB_pl_io (DD1.AB19  ), MB_dac (DD12.21)
DAC_D10_N: MB_pl_io (DD1.AB21  ), MB_dac (DD12.20)
DAC_D10_P: MB_pl_io (DD1.AA21  ), MB_dac (DD12.19)
DAC_D11_N: MB_pl_io (DD1.V20   ), MB_dac (DD12.18)
DAC_D11_P: MB_pl_io (DD1.U20   ), MB_dac (DD12.17)
DAC_D12_N: MB_pl_io (DD1.U21   ), MB_dac (DD12.16)
DAC_D12_P: MB_pl_io (DD1.T21   ), MB_dac (DD12.15)
DAC_D13_N: MB_pl_io (DD1.AB22  ), MB_dac (DD12.14)
DAC_D13_P: MB_pl_io (DD1.AA22  ), MB_dac (DD12.13)
DAC_D14_N: MB_pl_io (DD1.W22   ), MB_dac (DD12.12)
DAC_D14_P: MB_pl_io (DD1.V22   ), MB_dac (DD12.11)
DAC_D15_N: MB_pl_io (DD1.U22   ), MB_dac (DD12.10)
DAC_D15_P: MB_pl_io (DD1.T22   ), MB_dac (DD12.9)
DAC_RESET: MB_ps_io (DD1.G13   ), MB_dac (R139.1)
DAC_SCLK: MB_ps_io (D2.6 DD1.A9    ), MB_dac (R141.1)
DAC_SDIO: MB_ps_io (D2.5 DD1.B12   ), MB_dac (R142.1)
DAC_SDO: MB_ps_io (D2.2 DD1.F14   ), MB_dac (R143.1)
DIS_RS422_RX: MB_ps_io (DD2.2), MB_pl_io (DD1.AA6   )
DIS_RS422_TX: MB_ps_io (DD2.5), MB_pl_io (DD1.AB4   )
I2S1BCLK: MB_pl_io (DD1.AA4   ), MB_audio (R185.1)
I2S1DATA0: MB_pl_io (DD1.W6    ), MB_audio (R186.1)
I2S1DATA1: MB_pl_io (DD1.W5    ), MB_audio (R187.1)
I2S1MCLK: MB_pl_io (DD1.Y9    ), MB_audio (R188.1)
I2S1WCLK: MB_pl_io (DD1.Y6    ), MB_audio (R184.1)
PTT: MB_ps_io (DD5.6), MB_pl_io (DD1.V9    )
RS422_RX: MB_ps_io (DD3.2), MB_pl_io (DD1.Y8    )
RS422_TX: MB_ps_io (DD3.5), MB_pl_io (DD1.W7    )
TX_FAIL: MB_ps_io (R30.2 Z1.8), MB_pl_io (DD1.V7    )
TX_ON: MB_ps_io (R29.2 Z1.5), MB_pl_io (DD1.V5    )

## Assembly variants
HF of MB: not fitted C308 C309 C312 C313 C316 C317 C318 C319 C321 C322 L51 L52 L54 L55 T4 T5 XW4 XW5